# EAGLE board ECDL_CUR_CTRL (EAGLE 8.6.3)
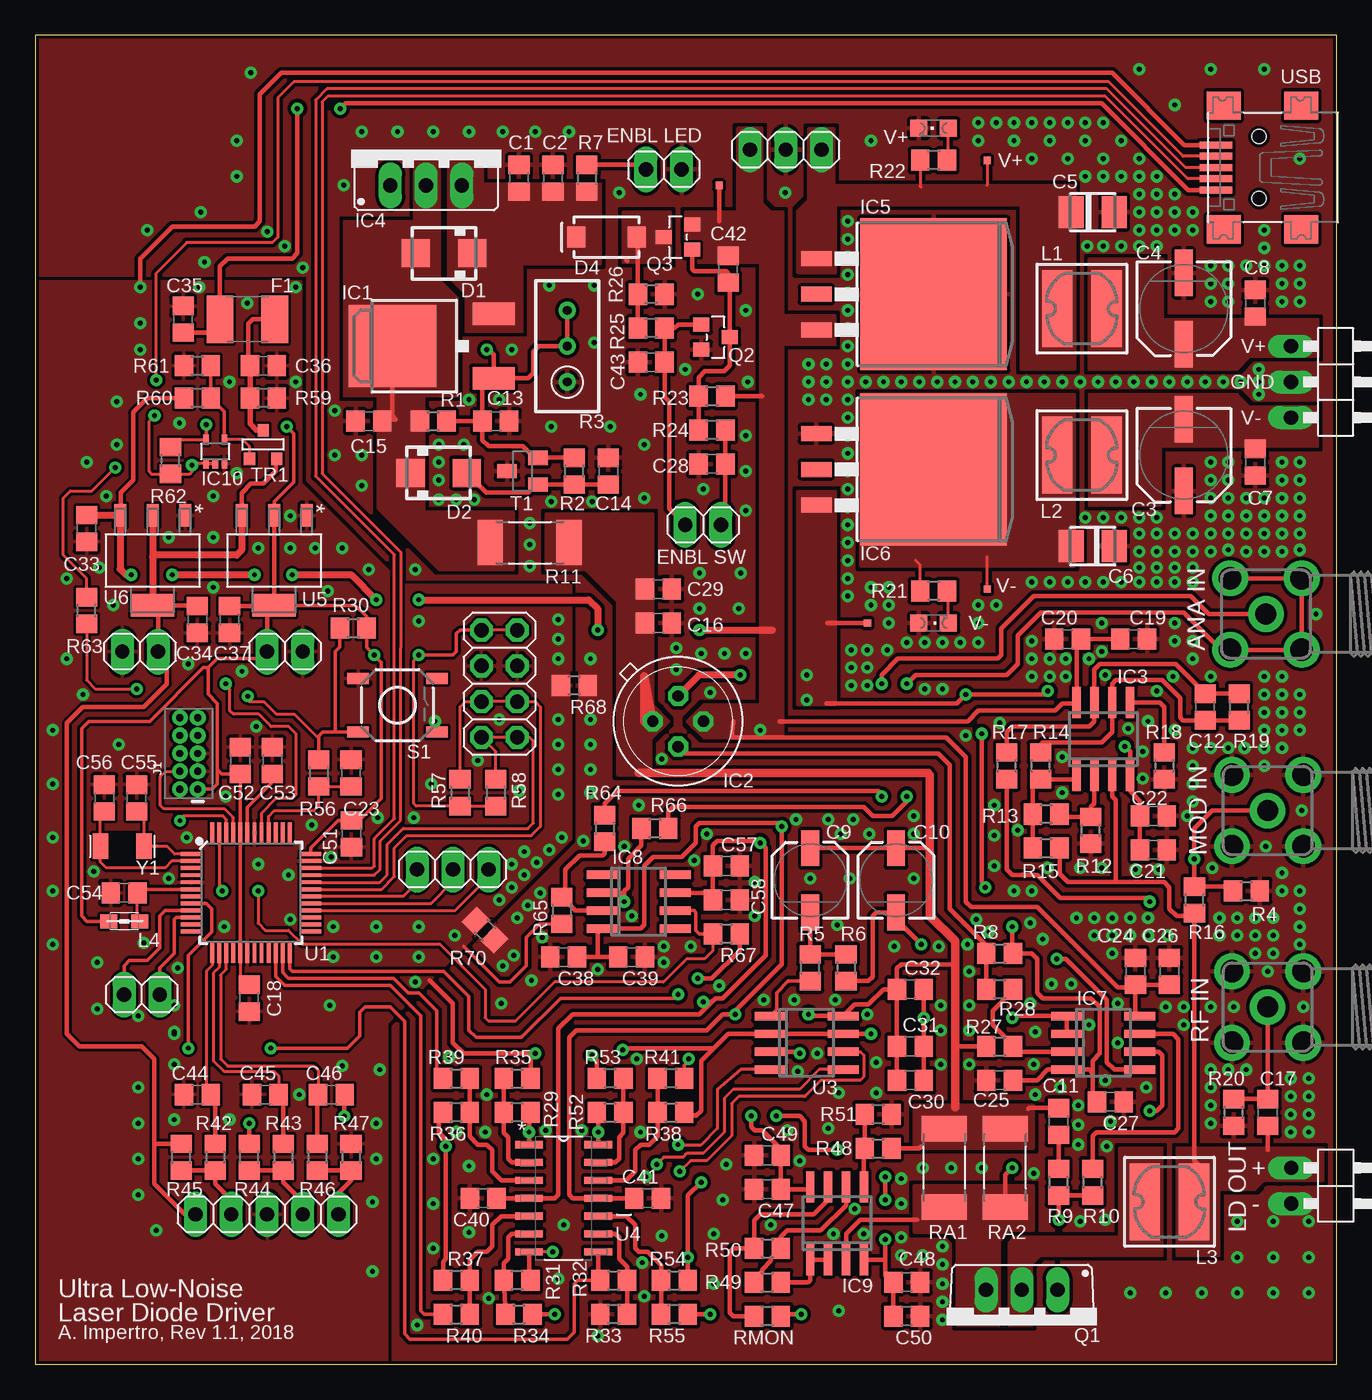
[diagram p2: board, top side]
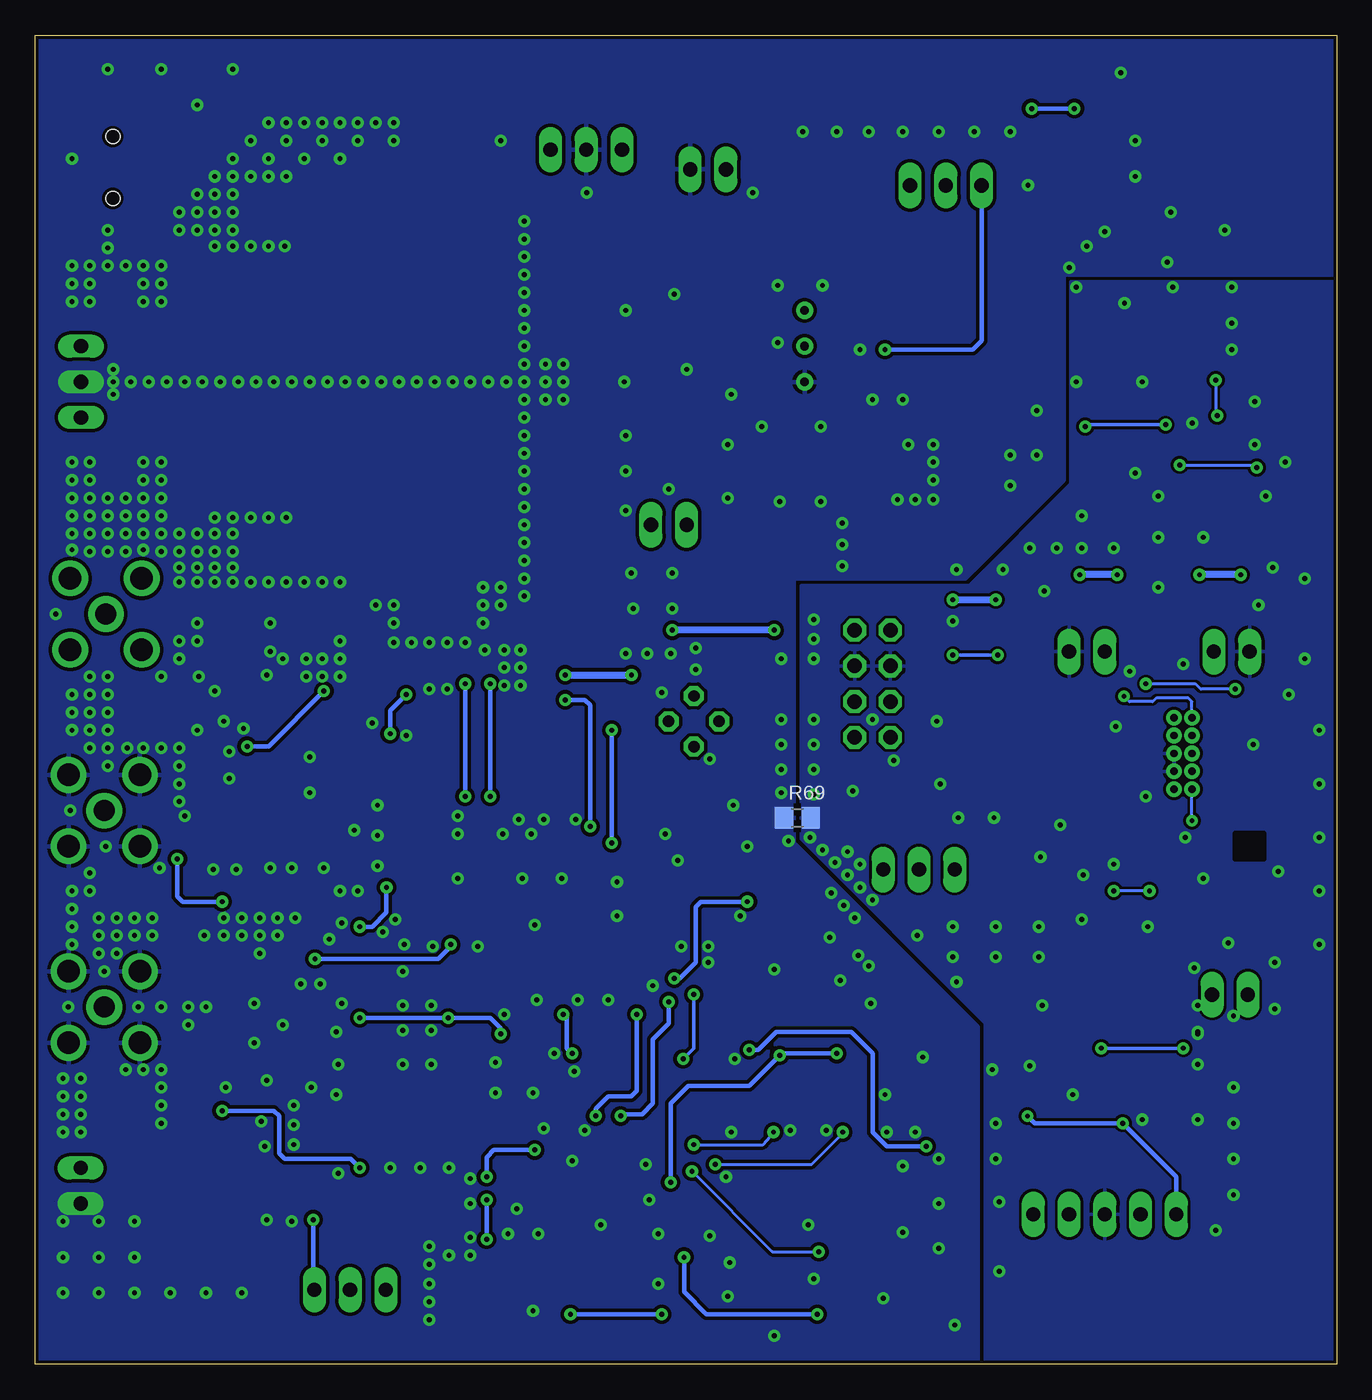
[diagram p3: board, bottom side, seen from below]

Size 92.5 x 94.5 mm. Coordinates in mm from the lower left corner, seen from the top.
Outline: 0,0 92.5,0 92.5,94.5 0,94.5 0,0
Copper layers (1*16): Top 0.035mm / dielectric 1.5mm / Bottom 0.035mm
Design rules "SparkFun": minimum track width 8mil, minimum drill 13mil, track to track 8mil, track to pad 8mil, pad to pad 8mil, via to via 8mil, smd to smd 8mil, copper to edge 10mil, drill to drill 8mil, minimum pad ring 12mil, minimum via ring 10mil, stop-mask expansion 4mil, vias tented up to drill 25mil, thermal gap 10mil

## Footprints (pad centres in the part's own frame; a part is rotated, then mirrored left to right if it is on the bottom)
C0805 = smd 1.3 x 1.5: 1 -0.95,0; 2 0.95,0
CSV-D = smd 3.302 x 1.27: + -2.54,0; - 2.54,0
C3528-21R/T = smd 1.778 x 2.286: + 1.525,0; - -1.525,0
CSV-C = smd 2.54 x 1.27: + -2.286,0; - 2.286,0
SMA = smd 2 x 2: A 2,0; C -2,0
SMA-DIODE = smd 1.27 x 1.47: A -2.15,0; C 2.15,0
PROTEZIONE_L1812 = smd 1.9 x 3.4: 1 -1.95,0; 2 1.95,0
DPACK = smd 1.6 x 3: 1 -2.28,-4.8; 3 2.28,-4.8 | smd 5.8 x 6.2: 4 0,2.38
TO39/4 = drill 0.813 octagon: 1 -1.27,-1.27; 2 1.27,-1.27; 3 1.27,1.27; 4 -1.27,1.27
SO08 = smd 0.6 x 2.2: 1 -1.905,-2.6; 2 -0.635,-2.6; 3 0.635,-2.6; 4 1.905,-2.6; 5 1.905,2.6; 6 0.635,2.6; 7 -0.635,2.6; 8 -1.905,2.6
317TS = drill 1.016 long: 1 -2.54,-2.54; 2 0,-2.54; 3 2.54,-2.54
TO263-3 = smd 1.067 x 2.159: 1 -2.54,-5.791; 2 0,-5.791; 3 2.54,-5.791 | smd 10.8 x 10.41: TAB 0,2.54
TO223-3 = smd 1.067 x 2.159: 1 -2.54,-7.061; 2 0,-7.061; 3 2.54,-7.061 | smd 10.8 x 10.41: TAB 0,1.27
SO8 = smd 0.6 x 2.2: 1 -1.905,-2.6; 2 -0.635,-2.6; 3 0.635,-2.6; 4 1.905,-2.6; 5 1.905,2.6; 6 0.635,2.6; 7 -0.635,2.6; 8 -1.905,2.6
INTEGRATEDCIRCUITS_SC70-5 = smd 0.4 x 0.7: 1 -0.65,-0.85; 2 0,-0.85; 3 0.65,-0.85; 4 0.65,0.85; 5 -0.65,0.85
2X5-PTH-1.27MM = drill 0.508 pad 1: 1 -2.54,-0.635; 2 -2.54,0.635; 3 -1.27,-0.635; 4 -1.27,0.635; 5 0,-0.635; 6 0,0.635; 7 1.27,-0.635; 8 1.27,0.635; 9 2.54,-0.635; 10 2.54,0.635
1X02 = drill 1.016 long: 1 -1.27,0; 2 1.27,0
1X03/90 = drill 1.016 long: 1 -2.54,-3.81; 2 0,-3.81; 3 2.54,-3.81
2X04 = drill 1.016 octagon: 1 -3.81,-1.27; 2 -3.81,1.27; 3 -1.27,-1.27; 4 -1.27,1.27; 5 1.27,-1.27; 6 1.27,1.27; 7 3.81,-1.27; 8 3.81,1.27
1X02/90 = drill 1.016 long: 1 -1.27,-3.81; 2 1.27,-3.81
1X05 = drill 1.016 long: 1 -5.08,0; 2 -2.54,0; 3 0,0; 4 2.54,0; 5 5.08,0
1X03 = drill 1.016 long: 1 -2.54,0; 2 0,0; 3 2.54,0
CD54 = smd 5.5 x 2.15: 1 0,1.75; 2 0,-1.75
PROTEZIONE_0805 = smd 1.2 x 1: 1 -1.1,0; 2 1.1,0
TO220BV = drill 1.016 long: D 0,-2.54; G -2.54,-2.54; S 2.54,-2.54
SOT-23 = smd 1.016 x 1.143: 1 -0.889,-1.016; 2 0.889,-1.016; 3 0,1.016
R0805 = smd 1.3 x 1.5: 1 -0.95,0; 2 0.95,0
RTRIM3296W = drill 0.61: 1 0,-2.54; 2 0,0; 3 0,2.54
R2512 = smd 1.8 x 3.2: 1 -2.8,0; 2 2.8,0
TACTILE_SWITCH_SMD_5.2MM = smd 1.524 x 0.762: 1 -2.794,1.905; 2 2.794,1.905; 3 -2.794,-1.905; 4 2.794,-1.905
SOT23-BEC = smd 1 x 1.4: B -0.95,-1.1; C 0,1.1; E 0.95,-1.1
PAD.02X.02 = smd 0.508 x 0.508: P$1 0,0
TRANSISTORS_SOT-23 = smd 0.787 x 0.889: 1 0.025,-1.016; 2 -0.94,1.016; 3 0.991,1.016
TQFP-48 = smd 1.5 x 0.28: 1 -4.25,2.75; 2 -4.25,2.25; 3 -4.25,1.75; 4 -4.25,1.25; 5 -4.25,0.75; 6 -4.25,0.25; 7 -4.25,-0.25; 8 -4.25,-0.75; 9 -4.25,-1.25; 10 -4.25,-1.75; 11 -4.25,-2.25; 12 -4.25,-2.75; 25 4.25,-2.75; 26 4.25,-2.25; 27 4.25,-1.75; 28 4.25,-1.25; 29 4.25,-0.75; 30 4.25,-0.25; 31 4.25,0.25; 32 4.25,0.75; 33 4.25,1.25; 34 4.25,1.75; 35 4.25,2.25; 36 4.25,2.75 | smd 0.28 x 1.5: 13 -2.75,-4.25; 14 -2.25,-4.25; 15 -1.75,-4.25; 16 -1.25,-4.25; 17 -0.75,-4.25; 18 -0.25,-4.25; 19 0.25,-4.25; 20 0.75,-4.25; 21 1.25,-4.25; 22 1.75,-4.25; 23 2.25,-4.25; 24 2.75,-4.25; 37 2.75,4.25; 38 2.25,4.25; 39 1.75,4.25; 40 1.25,4.25; 41 0.75,4.25; 42 0.25,4.25; 43 -0.25,4.25; 44 -0.75,4.25; 45 -1.25,4.25; 46 -1.75,4.25; 47 -2.25,4.25; 48 -2.75,4.25
SOIC-8 = smd 0.6 x 2.2: 1 -1.905,-2.6; 2 -0.635,-2.6; 3 0.635,-2.6; 4 1.905,-2.6; 5 1.905,2.6; 6 0.635,2.6; 7 -0.635,2.6; 8 -1.905,2.6
SOIC127P600X175-14N = smd 1.981 x 0.508: 1 -2.464,3.81; 2 -2.464,2.54; 3 -2.464,1.27; 4 -2.464,0; 5 -2.464,-1.27; 6 -2.464,-2.54; 7 -2.464,-3.81; 8 2.464,-3.81; 9 2.464,-2.54; 10 2.464,-1.27; 11 2.464,0; 12 2.464,1.27; 13 2.464,2.54; 14 2.464,3.81
SOT230P696X180-4N = smd 1.6 x 0.838: 1 -3.2,2.311; 2 -3.2,0; 3 -3.2,-2.311 | smd 1.6 x 3.099: 4 3.2,0
USB-MINIB = smd 0.5 x 2.308: D+ 0,4.064; D- -0.8,4.064; GND 1.6,4.064; ID 0.8,4.064; VBUS -1.6,4.064 | smd 2 x 2.4: GND1 -4.4,-2; GND2 -4.4,3.5; GND3 4.4,3.5; GND4 4.4,-2 | hole 1: -2.2,1; 2.2,1
CHIPLED_0805 = smd 1.2 x 1.2: A 0,-1.05; C 0,1.05
SMA90_DIP = drill 1.5 pad 2.54: ANTENNA 0,0 | drill 1.6 pad 2.54: GND1 -2.54,2.54; GND2 2.54,2.54; GND3 -2.54,-2.54; GND4 2.54,-2.54
CRISTALLI_RESONATOR_EPSON_FC_145 = smd 1.1 x 1.8: P$1 -1.55,0; P$2 1.55,0

## Placement (x,y rotation side)
C1  10nF  [C0805]  34.39,84.33 90 top
C2  10uF  [C0805]  36.8,84.33 90 top
C3  220uF  [CSV-D]  81.63,64.64 90 top
C4  220uF  [CSV-D]  81.63,75.06 90 top
C5  47uF  [C3528-21R/T]  75.15,81.92 180 top
C6  47uF  [C3528-21R/T]  75.15,58.17 0 top
C7  1uF  [C0805]  86.71,64.14 90 top
C8  1uF  [C0805]  86.71,75.44 90 top
C9  22uF  [CSV-C]  55.09,34.42 270 top
C10  22uF  [CSV-C]  61.18,34.42 270 top
C11  33nF  [C0805]  72.74,17.27 270 top
C12  1uF  [C0805]  83.15,46.74 90 top
C13  10uF  [C0805]  32.73,67.06 0 top
C14  1uF  [C0805]  40.74,63.5 90 top
C15  10uF  [C0805]  23.72,67.06 180 top
C16  22uF  [C0805]  44.29,52.7 0 top
C17  .01uF  [C0805]  87.6,17.91 90 top
C18  100nF  [C0805]  15.21,26.04 270 top
C19  100nF  [C0805]  78.07,51.56 0 top
C20  10uF  [C0805]  73.38,51.56 180 top
C21  10uF  [C0805]  79.47,36.58 0 top
C22  100nF  [C0805]  79.47,38.99 0 top
C23  10nF  [C0805]  22.45,42.04 90 top
C24  10uF  [C0805]  78.2,27.94 90 top
C25  10uF  [C0805]  68.55,20.19 0 top
C26  100nF  [C0805]  80.61,27.94 90 top
C27  100nF  [C0805]  76.42,18.67 180 top
C28  1uF  [C0805]  48.1,64.01 180 top
C29  100nF  [C0805]  44.29,55.12 0 top
C30  10uF  [C0805]  62.2,20.19 0 top
C31  100nF  [C0805]  62.2,22.61 0 top
C32  100nF  [C0805]  62.2,26.67 0 top
C33  10uF  [C0805]  3.65,59.44 270 top
C34  10uF  [C0805]  11.53,52.96 270 top
C35  10nF  [C0805]  10.51,74.3 90 top
C36  10uF  [C0805]  16.23,70.99 180 top
C37  10uF  [C0805]  13.81,52.96 270 top
C38  100nF  [C0805]  37.56,28.96 0 top
C39  10uF  [C0805]  42.39,28.96 180 top
C40  100nF  [C0805]  31.85,11.81 180 top
C41  100nF  [C0805]  43.53,11.81 0 top
C42  0.1uF  [C0805]  49.24,77.85 270 top
C43  0.1uF  [C0805]  43.78,71.25 180 top
C44  100nF  [C0805]  11.53,19.18 180 top
C45  100nF  [C0805]  16.35,19.18 180 top
C46  100nF  [C0805]  21.05,19.18 180 top
C47  10uF  [C0805]  52.04,12.45 180 top
C48  10uF  [C0805]  61.95,5.84 180 top
C49  100nF  [C0805]  52.04,14.86 180 top
C50  100nF  [C0805]  61.95,3.43 180 top
C51  100nF  [C0805]  22.48,37.72 270 top
C52  100nF  [C0805]  14.57,42.93 90 top
C53  1uF  [C0805]  16.86,42.93 90 top
C54  100nF  [C0805]  6.32,33.53 180 top
C55  22pF  [C0805]  7.21,40.26 270 top
C56  22pF  [C0805]  4.92,40.26 270 top
C57  10uF  [C0805]  49.12,35.43 0 top
C58  100nF  [C0805]  49.12,33.02 180 top
D1  1N4001  [SMA]  29.05,78.99 180 top
D2  1N4001  [SMA]  28.67,63.37 0 top
D4  3A/40V/500mV  [SMA-DIODE]  40.61,80.14 180 top
F1  MF-MSMF050-2 500mA  [PROTEZIONE_L1812]  15.08,74.3 0 top
IC1  LM317MDT  [DPACK]  27.78,72.39 90 top
IC2  LM399H  [TO39/4]  45.69,45.72 315 top
IC3  OPA2227D  [SO08]  75.92,44.45 0 top
IC4  [317TS]  27.78,86.36 0 top
IC5  LM340S-12  [TO263-3]  61.31,76.07 270 top
IC6  L7912  [TO223-3]  62.58,63.63 270 top
IC7  AD8676  [SO8]  75.92,22.86 270 top
IC8  TL071D  [SO08]  42.9,32.89 270 top
IC9  AD8676  [SO8]  56.99,10.03 0 top
IC10  74LVC1G125DCKR  [INTEGRATEDCIRCUITS_SC70-5]  12.8,64.9 0 top
J1  CORTEX_DEBUG_PTH  [2X5-PTH-1.27MM]  10.92,43.43 90 top
JP1  ENBL  [1X02]  47.47,59.69 0 top
JP2  [1X03/90]  93.06,69.85 270 top
JP3  [2X04]  32.99,48.39 270 top
JP4  [1X02/90]  93.08,12.7 270 top
JP5  EN_LED  [1X02]  44.67,84.96 0 top
JP7  [1X05]  16.48,10.67 0 top
JP8  [1X02]  7.59,26.29 180 top
JP9  [1X02]  7.46,50.67 180 top
JP10  [1X03]  29.69,35.18 180 top
JP11  [1X02]  17.75,50.67 0 top
JP12  [1X03]  53.34,86.36 180 top
L1  CD54  [CD54]  74.39,75.06 270 top
L2  CD54  [CD54]  74.39,64.64 90 top
L3  100uH  [CD54]  80.61,11.56 90 top
L4  MH2029-300Y  [PROTEZIONE_0805]  6.32,31.5 180 top
Q1  IRF9Z14  [TO220BV]  70.12,2.76 180 top
Q2  2N7002  [SOT-23]  48.36,73.03 270 top
Q3  SSM3J328R,LF  [SOT-23]  45.69,80.14 90 top
R1  240R  [R0805]  28.29,67.06 0 top
R2  50K  [R0805]  38.32,63.5 90 top
R3  5K  [RTRIM3296W]  37.81,72.39 0 top
R4  50R  [R0805]  86.08,33.66 0 top
R5  3K  [R0805]  55.09,28.19 90 top
R6  3K  [R0805]  57.63,28.19 270 top
R7  1K  [R0805]  39.21,84.33 270 top
R8  7.5K  [R0805]  68.55,29.21 0 top
R9  100R  [R0805]  72.74,12.95 90 top
R10  10K  [R0805]  75.15,12.95 90 top
R11  1.5R  [R2512]  35.15,58.42 0 top
R12  1K  [R0805]  75.03,37.97 90 top
R13  1K  [R0805]  71.85,39.12 180 top
R14  1K  [R0805]  71.47,42.55 90 top
R15  1K  [R0805]  71.85,36.7 0 top
R16  1K  [R0805]  82.39,33.02 90 top
R17  2K  [R0805]  69.06,42.55 90 top
R18  1K  [R0805]  80.23,42.55 270 top
R19  1K  [R0805]  85.57,46.74 90 top
R20  10K  [R0805]  85.19,17.91 90 top
R21  2K  [R0805]  63.85,54.99 180 top
R22  2K  [R0805]  63.85,85.6 180 top
R23  10K  [R0805]  48.1,68.83 0 top
R24  100K  [R0805]  48.1,66.42 180 top
R25  10K  [R0805]  43.78,73.66 180 top
R26  10K  [R0805]  43.78,76.07 180 top
R27  28.7K  [R0805]  68.55,22.61 0 top
R28  11K  [R0805]  68.55,26.67 180 top
R29  10K  [R0805]  34.26,17.91 180 top
R30  10K  [R0805]  22.61,52.35 0 top
R31  10K  [R0805]  34.26,5.97 180 top
R32  10K  [R0805]  41.12,5.97 0 top
R33  10K  [R0805]  41.12,3.56 180 top
R34  10K  [R0805]  34.39,3.56 0 top
R35  10K  [R0805]  34.26,20.32 0 top
R36  10K  [R0805]  29.94,17.91 180 top
R37  10K  [R0805]  29.94,5.97 180 top
R38  10K  [R0805]  45.18,17.91 0 top
R39  10K  [R0805]  29.94,20.32 0 top
R40  10K  [R0805]  29.94,3.56 0 top
R41  10K  [R0805]  45.18,20.32 180 top
R42  10K  [R0805]  12.8,14.73 270 top
R43  10K  [R0805]  17.62,14.73 270 top
R44  10K  [R0805]  15.21,14.73 90 top
R45  10K  [R0805]  10.38,14.73 90 top
R46  10K  [R0805]  20.04,14.73 270 top
R47  100K  [R0805]  22.45,14.73 270 top
R48  10K  [R0805]  59.91,15.37 0 top
R49  10K  [R0805]  52.04,5.84 0 top
R50  10K  [R0805]  52.04,8.26 0 top
R51  10K  [R0805]  59.91,17.78 180 top
R52  10K  [R0805]  40.86,17.91 0 top
R53  10K  [R0805]  40.86,20.32 180 top
R54  10K  [R0805]  45.44,5.97 0 top
R55  10K  [R0805]  45.44,3.56 180 top
R56  330R  [R0805]  20.16,42.04 270 top
R57  10K  [R0805]  30.2,40.64 270 top
R58  10K  [R0805]  32.73,40.64 270 top
R59  10K  [R0805]  16.23,68.71 180 top
R60  100K  [R0805]  11.53,68.71 180 top
R61  100K  [R0805]  11.53,70.99 0 top
R62  100K  [R0805]  9.62,64.26 90 top
R63  330R  [R0805]  3.65,53.59 90 top
R64  10K  [R0805]  40.48,38.1 270 top
R65  10K  [R0805]  37.43,32.26 270 top
R66  10K  [R0805]  44.04,38.1 180 top
R67  10K  [R0805]  49.12,30.61 180 top
R68  0R  [R0805]  38.32,48.26 180 top
R69  0R  [R0805]  38.32,38.86 0 bottom
R70  0R  [R0805]  31.97,30.86 135 top
RA1  100R  [R2512]  64.61,13.97 90 top
RA2  100R  [R2512]  68.93,13.97 90 top
RMON  50R or 0R  [R0805]  52.04,3.43 180 top
S1  MOM SWITCH  [TACTILE_SWITCH_SMD_5.2MM]  25.75,46.86 0 top
T1  MMBT2907  [SOT23-BEC]  34.64,63.5 90 top
TP1  [PAD.02X.02]  67.66,85.6 0 top
TP2  [PAD.02X.02]  67.66,55.12 0 top
TP3  [PAD.02X.02]  48.61,83.82 0 top
TP4  [PAD.02X.02]  59.15,52.7 0 top
TR1  PMV48XP  [TRANSISTORS_SOT-23]  16.23,65.41 180 top
U1  ATSAMD21G-A  [TQFP-48]  15.34,33.53 0 top
U3  AD5541  [SOIC-8]  54.83,22.86 270 top
U4  TS514AID  [SOIC127P600X175-14N]  37.56,11.81 0 top
U5  LM1117IMP-3.3  [SOT230P696X180-4N]  16.99,57.15 270 top
U6  LM1117IMP-5.0  [SOT230P696X180-4N]  8.35,57.15 270 top
USB  [USB-MINIB]  87.98,85.09 90 top
V+  [CHIPLED_0805]  63.85,87.88 90 top
V-  [CHIPLED_0805]  63.85,52.7 270 top
X1  [SMA90_DIP]  87.59,39.37 270 top
X2  [SMA90_DIP]  87.59,25.4 270 top
X3  [SMA90_DIP]  87.47,53.34 270 top
Y1  32,768Khz_SMD  [CRISTALLI_RESONATOR_EPSON_FC_145]  6.19,36.83 0 top

## Tracks (layer width: path | path; a pad name or v marks a point on that pad's centre or on a via)
+3V3  (via drill 0.35)
  Top 0.203: U1.17 14.59,26.72 C18.1 | JP3.2 JP3.1 | v27.27,50.42 26.89,50.04 26.89,39.88 27.08,39.69 R57.2 R58.2 | R62.2 9.97,65.75 IC10.5
  Top 0.254: v12.16,66.8 12.15,66.66 IC10.5 | U1.17 U1.44 14.59,41.96 C52.1 13.27,41.98 12.95,42.29 | 12.29,49.53 12.92,50.16 16.23,50.16 16.48,50.42 JP11.1 | v17.88,66.67 18.38,66.17 18.38,62.74 16.99,61.34 U5.2 | U5.4 22.76,53.95 23.56,53.15 R30.2 23.56,50.96 v24.1,50.42 24.61,49.91 24.61,40.23 23.05,38.67 C51.1 21.52,38.67 19.59,36.73 U1.36 | v27.27,50.42 29.69,50.42 29.94,50.67 29.94,51.94 30.2,52.2 JP3.1 | 12.29,49.53 12.29,47.66 12.95,46.99 12.95,42.29 | J1.1 12.57,40.89 12.95,41.27 12.95,42.29 | L4.2 3.68,31.5 3.3,31.88 3.3,45.21 3.81,45.72 8.13,45.72 11.94,49.53 12.29,49.53
  Top 0.305: C37.1 16.95,53.91 | 16.99,53.91 16.95,53.91 | U5.2 U5.4 | U5.4 16.95,53.91 | U5.4 16.48,53.44 JP11.1
  Bottom 0.254: v12.16,66.8 17.75,66.8 v17.88,66.67 | v27.27,50.42 v24.1,50.42
+5V  (via drill 0.33, 0.35)
  Top 0.305: 10.06,16.06 R45.2 8.54,15.68 8.48,15.75 | JP7.1 10.64,10.67 8.48,12.83 8.48,15.75 | R44.2 v15.21,17.14 | 9.24,53.95 U6.4 8.73,53.57 JP9.1 9.37,50.04 9.37,48.39 7.72,46.74 3.4,46.74 2.25,45.59 2.25,23.5 3.14,22.61 7.59,22.61 8.48,21.72 8.48,15.75 | 9.24,53.95 11.48,53.95 C34.1 | U5.3 14.68,61.95 15.34,62.61 16.23,62.61 17.11,63.5 17.11,64.34 TR1.2 | 9.37,53.82 9.24,53.95 | v21.97,17.65 21.97,19.15 C46.1
  Top 0.508: U6.2 8.35,57.4 | 8.35,57.4 U6.4 | U5.3 14.68,57.89 14.32,57.53 8.48,57.53 8.35,57.4
  Bottom 0.305: JP7.1 11.4,13.34 v15.21,17.14 21.46,17.14 v21.97,17.65
+12V  (via drill 0.35)
  Top 0.305: TP3.P$1 48.61,81.28 | R23.2 51.66,68.83 | 74.01,47.95 73.88,46.99 | 49.63,45.72 49.5,44.58 64.74,44.58 66.14,43.18 66.14,32.89 66.52,32.51 71.22,32.51 76.93,26.8 78.2,26.8 | 73.88,46.99 IC3.8 74.01,51.25 C20.1 C19.1 | C40.1 U4.4 36.93,11.81 37.18,12.06 37.18,23.88 38.2,24.89 47.21,24.89 48.1,25.78 | IC9.8 54.9,12.45 C47.1 C49.1 52.99,15.31 51.66,16.64 51.15,16.64 50.9,16.89 v50.9,17.65 | C26.1 C24.1 78.2,26.8 | 78.2,26.8 78.2,25.08 IC7.8 | 73.88,46.99 72.99,46.99 72.49,46.48 67.03,46.48 66.26,45.72 52.93,45.72 | 48.1,25.78 48.36,26.04 48.86,26.04 51.91,29.08 51.91,36.7 v51.53,37.08 51.4,37.21 48.48,37.21 48.17,36.9 C57.1 C58.2 | v47.47,25.78 48.1,25.78 | R60.2 7.97,68.71 6.95,67.69 6.95,62.87 6.07,61.98 6.07,60.38 U6.3 | 48.04,32.89 C58.2 | IC8.7 47.66,33.53 C58.2
  Top 0.508: C33.1 3.69,60.35 U6.3 6.04,56.54 6.45,56.13 v6.83,56.13 | v47.21,52.2 52.42,52.2 | v9.75,56.13 v15.59,56.13 | v18.26,56.13 22.45,56.13 v24.23,54.36 | v27.27,54.36 39.34,54.36 39.97,53.72 v39.97,52.2
  Bottom 0.305: v51.53,37.08 v51.53,45.09 | v50.9,17.65 50.77,17.78 49.37,17.78 48.61,18.54 48.61,23.11 47.47,24.26 v47.47,25.78
  Bottom 0.508: v39.97,52.2 v47.21,52.2 | v6.83,56.13 v9.75,56.13 | v15.59,56.13 v18.26,56.13 | v24.23,54.36 v27.27,54.36
  pour Top (no thermals): 53.18,81.92 52.32,81.92 51.69,82.55 51.69,87.88 49.91,87.88 49.91,81.92 46.2,81.92 46.2,78.36 51.53,78.36 51.53,46.86 53.18,46.86 53.18,72.52 56.87,72.52 56.87,74.55 53.18,74.55
  pour Top (no thermals): 53.18,46.86 47.47,46.86 46.32,45.72 47.47,44.58 53.18,44.58
+15V
  pour Top (no thermals): 91.16,71.63 86.33,71.63 85.44,70.74 74.9,70.74 74.9,78.61 80.11,78.61 80.11,74.3 91.16,74.3
-12V  (via drill 0.35)
  Top 0.305: TP4.P$1 56.31,52.7 | C41.1 U4.11 38.2,11.81 37.94,12.06 37.94,23.24 38.45,23.75 47.72,23.75 48.86,24.89 49.5,24.89 | C27.2 75.15,18.99 75.15,20.7 | 75.15,20.7 74.9,20.95 IC7.4 71.98,20.95 71.22,20.19 C25.2 | C21.1 C22.1 78.52,40.07 77.82,40.77 IC3.4 77.82,43.56 v77.44,43.94 | v71.98,47.88 71.98,47.75 71.85,47.62 v66.14,47.62 65.5,46.99 56.23,46.99 | v67.53,33.91 67.28,34.29 v67.28,44.83 | 75.15,20.7 75.15,21.59 75.66,22.1 75.66,25.4 75.03,26.04 71.6,26.04 71.22,26.42 71.22,28.83 70.83,29.21 R8.2 69.44,29.21 v69.44,31.11 | 60.42,7.49 v60.42,8.89 | C48.2 60.99,5.71 | 60.99,5.71 C50.2 | 60.42,7.49 60.42,6.29 60.99,5.71 | 60.42,7.49 60.36,7.43 IC9.4 | v60.42,11.68 v60.42,13.34 | v56.99,15.24 54.96,15.24 54.71,15.49 54.71,17.27 54.33,17.65 v52.67,17.65 | v49.75,24.89 49.5,24.89 | 49.5,24.89 53.05,28.45 v53.05,38.23 52.8,38.48 47.21,38.48 46.96,38.23 46.96,37.08 45.94,36.07 43.91,36.07 43.28,35.43 43.28,31.24 43.02,30.99 IC8.4 39.97,30.67 39.97,28.96 | C39.2 39.97,28.96 | 39.97,28.96 C38.2
  Top 0.508: v50.12,49.02 47.2,49.02 IC2.4
  Bottom 0.305: v71.98,47.88 75.92,43.94 v77.44,43.94 | v67.53,33.91 67.53,32.13 68.55,31.11 v69.44,31.11 | v60.42,8.89 v60.42,11.68 | v60.42,13.34 60.42,14.73 59.91,15.24 v56.99,15.24 | v52.67,17.65 52.67,18.16 51.78,19.05 50.13,19.05 49.75,19.43 v49.75,24.89 | v67.28,44.83 67.28,46.48 v66.14,47.62 | v53.05,38.23 53.05,46.86 53.44,47.24 v54.83,47.24
  Bottom 0.508: v54.83,49.02 v50.12,49.02
  pour Top (no thermals): 54.2,46.86 54.2,62.1 56.87,62.1 56.87,46.86
-15V
  pour Top (no thermals): 91.16,68.07 86.33,68.07 85.44,68.96 74.9,68.96 74.9,61.09 79.98,61.09 79.98,65.28 91.16,65.28
CS_DAC  (via drill 0.35)
  Top 0.254: R41.1 46.13,21.27 46.58,21.72 v46.45,21.72 | v45.69,26.29 45.44,26.04 37.34,26.04 34.54,23.24 31.34,23.24 30.83,23.75 30.83,26.16 29.05,27.94 18.26,27.94 18.09,28.11 U1.24
  Bottom 0.254: v46.45,21.72 45.69,22.48 v45.69,26.29
DACGND  (via drill 0.35)
  Top 0.305: IC7.2 IC7.1 69.56,24.77 v69.44,24.64 | 28.61,6.1 R37.2 28.99,7.3 29.18,7.49 v29.18,15.49 29.18,16 28.67,16.51 28.67,17.46 R36.2 | C30.2 C31.2 v63.15,24.64 C32.2 | v59.41,23.5 U3.7 U3.2 49.24,23.5 48.23,22.48 | R38.2 46.96,17.65 47.34,18.03 47.34,21.59 48.23,22.48 | 48.23,22.48 41.88,22.48 v41.75,22.35
  Bottom 0.305: v59.41,23.5 59.41,23.88 60.17,24.64 v63.15,24.64 v69.44,24.64 | v41.75,22.35 41.12,22.35 39.85,23.62 34.51,23.62 32.99,22.1 32.99,16.51 31.97,15.49 v29.18,15.49
DCLK  (via drill 0.35)
  Top 0.203: U3.5 55.72,20.95 54.33,19.56 49.63,19.56 48.99,18.92 48.99,16.51 47.47,14.99 46.32,14.99 46.07,14.73 44.67,14.73 v44.16,14.22
  Top 0.305: 34.95,15.76 U4.1 v35.1,16.51 35.1,17.54 R29.1
  Bottom 0.203: v44.16,14.22 37.31,14.22 35.15,16.38 v35.1,16.51
DCS  (via drill 0.35)
  Top 0.203: U3.4 50.13,20.95 48.48,19.56 48.48,16.76 47.34,15.62 v45.69,15.62
  Top 0.305: R52.1 40.02,17.51 v40.02,16.51 U4.14
  Bottom 0.203: v45.69,15.62 40.79,15.62 v40.02,16.51
  Bottom 0.305: 39.97,16.38 v40.02,16.51
DCURMON  (via drill 0.35)
  Top 0.254: R32.1 38.58,5.97 38.32,5.71 38.32,2.29 37.81,1.78 26.64,1.78 26.26,2.16 26.26,24.38 25.24,25.4 23.46,25.4 23.08,25.02 23.08,23.37 22.19,22.48 v16.73,22.48 | v10.89,22.48 10.89,29.08 12.54,30.73 12.54,32.38 12.15,32.78 U1.8
  Top 0.305: R32.1 40.02,6.11 U4.8
  Bottom 0.254: v16.73,22.48 v10.89,22.48
DDATA  (via drill 0.35)
  Top 0.203: U3.6 58.64,22.23 58.9,21.97 58.9,20.45 58.64,20.19 55.85,20.19 54.71,19.05 50.01,19.05 49.5,18.54 49.5,16.26 47.72,14.48 46.58,14.48 v45.82,13.72 | v36.8,8 U4.7
  Top 0.305: U4.7 35.1,6.08 R31.1
  Bottom 0.203: v45.82,13.72 40.1,8 v36.8,8
DGND  (via drill 0.35)
  Top 0.203: U1.5 10.52,34.28 10.51,34.29
  Top 0.254: R65.2 35.85,31.31 34.89,30.35 34.89,28.32 33.75,27.18 32.99,27.18 30.45,29.72
  Top 0.305: v39.59,21.97 39.91,21.65 R53.2 | R35.2 35.21,21.78 v35.53,22.1 30.45,22.1 29.69,22.86 29.69,25.65 28.04,27.3 | R54.2 v46.38,7.62 46.38,12 v47.34,12.95 | v36.93,3.56 R34.2 | USB.GND 81.68,86.69 76.55,91.82 17.5,91.82 15.97,90.3 15.97,81.28 15.59,80.9 9.75,80.9 7.46,78.61 v7.46,76.58
  Bottom 0.254: 39.47,22.1 v39.59,21.97
  Bottom 0.305: v47.34,12.95 47.34,18.54 46.07,19.81 41.75,19.81 v39.59,21.97 | v46.38,7.62 46.38,5.14 44.8,3.56 v36.93,3.56 | v35.53,22.1 39.47,22.1
  other vias: 19.65,38.35 31.46,42.93 32.99,45.85 34.39,40.77 28.16,41.27 26.89,38.86 27.02,27.18 21.18,31.11 20.92,25.53 15.84,35.56 18,34.8 18.13,31.62 13.43,31.11 9.49,34.54 7.72,29.97 10.13,28.19 9.88,23.5 9.88,25.53 9.88,23.62 9.88,21.34 9.88,17.4 13.81,17.4 18.77,19.18 21.81,21.21 24.48,20.95 24.23,17.14 4.41,25.27 4.41,28.57 4.16,35.05 10.76,37.47 21.05,36.07 28.42,45.72 32.99,33.02 33.88,33.91 33.88,35.56 34.77,34.8 35.66,35.69 36.55,36.58 37.43,37.47 37.18,40.51 37.18,42.29 37.18,44.07 37.18,45.85 37.18,51.56 37.18,52.96 37.18,50.16 27.27,52.83 5.94,44.07 14.7,49.28 24.35,38.86 20.8,54.99 10.89,49.78 5.56,53.98 4.54,56.64 9.49,58.8 12.67,58.8 12.67,61.72 15.84,58.04 18.13,60.33 18.13,58.04 19.91,58.04 21.81,58.04 23.72,56.52 14.32,63.37 5.05,61.72 10.26,66.93 13.81,69.85 18.51,69.85 18.51,76.58 15.08,75.44 11.65,76.58 7.46,74.04 7.46,72.14 5.81,65.41 5.81,68.45 3.4,47.62 23.97,11.56 24.23,14.61 23.97,6.6 8.61,9.53 7.33,12.06 7.33,14.61 7.33,17.14 7.33,19.68 7.33,24.77 1.24,29.84 1.24,33.66 1.24,37.47 1.24,41.27 1.24,45.09 2.25,50.16 2.25,55.88 3.65,64.14 34.77,36.45 21.18,28.96 24.23,28.96 27.27,28.96 24.23,31.11 27.27,31.11 29.81,30.48 12.67,55.24 15.72,45.34 13.56,40.39
  pour Top (isolate 0.203, rank 6): -12.22,55.24 -12.1,76.96 18.89,76.96 18.89,62.61 26.13,55.37 38.07,55.37 38.07,37.34 24.99,24.26 24.99,-6.22 -12.22,-6.22
  pour Bottom (isolate 0.203, rank 6): -12.22,-6.22 -12.22,76.96 18.89,76.96 18.89,62.61 26.13,55.37 38.07,55.37 38.07,37.34 24.99,24.26 24.99,-6.22
  pour Top (no thermals): 29.94,31.5 31.97,33.53 32.99,32.51 30.96,30.48
  pour Top (no thermals): 37.94,49.4 36.16,49.4 36.16,47.12 37.94,47.12
  pour Bottom (no thermals): 37.94,40.01 36.29,40.01 36.29,37.72 37.94,37.72
ENCA
  Top 0.203: U1.14 13.09,28.23 12.67,27.81 12.67,21.59 13.43,20.83 16.99,20.83 17.3,20.51 C45.1
  Top 0.305: R43.1 17.62,19.24 C45.1
ENCB
  Top 0.203: U1.13 12.59,28.36 12.16,27.94 12.16,19.56 12.48,19.24 C44.1
  Top 0.305: R42.1 12.8,18.86 C44.1
ENCBTN
  Top 0.203: U1.15 13.59,28.09 13.18,27.69 13.18,21.72 13.69,21.21 19.78,21.21 20.1,20.89 C46.2
  Top 0.305: R46.1 20.04,18.98 C46.2
GND  (via drill 0.35)
  other vias: 90.52,20.32 61.56,7.75 62.83,69.85 81.88,69.85 43.28,65.41 31.21,61.47 77.69,45.21 50.52,74.93 39.72,76.71 50.52,60.71 30.83,68.58 72.99,40.64 74.26,35.31 52.29,9.91 56.74,9.27 58.26,11.05 61.56,13.21 43.28,61.59 36.67,61.34 35.15,56.77 28.67,61.47 28.67,64.14 30.45,65.41 35.15,59.82 33.88,72.14 36.55,76.71 36.67,66.67 63.09,13.97 65.12,13.97 67.28,13.97 74.26,10.16 76.04,10.29 58.9,9.27 61.56,11.43 61.56,9.02 71.09,23.62 70.96,21.34 66.39,23.75 66.39,25.53 66.39,21.34 66.39,27.94 71.09,19.18 72.87,19.68 74.14,18.41 76.04,20.19 76.93,22.86 74.9,24.13 76.93,25.65 73.63,27.05 72.23,27.05 70.71,25.65 70.71,31.37 71.6,30.23 64.23,29.72 57.88,34.54 62.45,34.54 66.9,31.62 67.79,30.73 74.14,17.02 74.14,15.62 76.42,17.27 78.96,19.68 70.96,13.59 76.17,15.49 81.63,25.4 80.36,25.4 66.26,29.84 83.53,20.95 83.53,19.68 83.53,18.41 83.53,25.4 85.19,25.4 89.25,20.32 89.25,19.05 90.52,19.05 90.14,25.4 87.6,27.94 76.55,29.21 59.79,19.3 59.15,24.89 64.36,21.34 64.36,23.75 64.36,25.53 56.87,25.91 53.94,25.91 30.83,9.4 55.59,22.1 54.2,20.83 56.99,31.24 59.79,21.46 56.36,16.76 53.44,16.64 42.77,21.72 63.09,7.75 43.4,13.34 36.29,16.64 72.99,43.18 70.83,48.9 68.55,45.59 68.17,39.75 68.17,37.59 68.17,35.43 69.82,37.97 78.2,35.18 79.85,35.18 81.88,38.99 71.98,35.31 75.79,35.31 61.06,29.72 55.09,34.54 16.48,80.52 86.96,69.85 80.61,69.85 79.34,69.85 74.26,69.85 72.99,69.85 71.72,69.85 69.18,69.85 64.1,69.85 61.56,69.85 59.02,69.85 54.96,71.12 54.96,68.58 56.23,71.12 56.23,68.58 57.75,71.12 57.75,66.04 57.75,64.77 57.75,63.5 57.75,60.96 57.75,57.15 57.75,55.88 59.41,53.98 57.75,73.66 57.75,76.2 57.75,78.74 57.75,80.01 78.45,79.5 79.72,79.5 81,80.64 19.02,77.98 17.75,79.5 12.03,78.36 66.14,44.7 91.03,53.34 80.87,48.9 76.04,49.02 27.15,2.79 28.29,11.43 32.1,19.18 51.78,25.91 44.67,28.57 39.97,28.07 46.58,29.72 44.67,29.72 42.39,31.88 51.15,34.29 51.15,31.88 46.83,35.81 47.72,37.72 42.9,39.75 41.88,36.83 54.07,38.73 56.36,38.73 58.13,38.73 57.25,37.72 59.28,37.72 62.45,38.99 62.45,37.72 43.02,16.51 57.12,19.3 54.33,14.48 64.48,7.11 64.48,5.71 64.48,4.45 64.48,3.17 64.48,8.38 57.12,3.81 48.23,5.71 48.23,9.27 44.55,9.14 48.86,11.68 49.12,14.22 43.15,7.24 43.28,4.83 37.56,9.91 37.18,6.1 32.23,4.7 28.29,8.26 28.29,14.61 30.83,14.1 29.94,16.51 31.97,16.51 29.43,21.84 38.83,16.64 48.61,26.92 74.01,31.75 75.28,31.75 76.55,31.75 77.82,31.75 79.09,31.75 75.28,30.48 76.55,30.48 77.82,30.48 79.09,30.48 80.49,30.48 70.83,33.66 69.56,33.66 81.63,24.13 84.81,20.95 86.08,20.95 83.53,17.14 89.25,17.78 90.52,17.78 90.52,16.51 89.25,16.51 84.17,31.75 84.17,30.48 85.44,31.75 85.44,30.48 86.71,31.75 86.71,30.48 86.71,29.21 87.98,29.21 87.98,30.48 87.98,31.75 83.66,35.31 78.71,41.66 78.71,43.56 79.09,45.72 82.27,43.81 82.27,42.55 82.27,41.27 82.27,40.01 83.53,43.81 84.81,43.81 85.95,43.81 81,45.09 79.72,47.88 75.79,50.67 74.9,50.16 72.11,48.9 72.11,50.16 70.83,51.44 70.83,50.16 73.25,48.9 73.25,50.16 75.79,52.7 81,52.7 81,51.44 82.27,51.44 82.27,50.16 83.53,48.9 64.48,48.01 63.22,48.01 58.01,48.26 59.15,48.26 58.01,49.53 59.15,49.53 59.15,50.8 58.01,50.8 60.55,50.8 47.98,47.75 44.55,43.05 33.12,25.65 35.27,27.3 33.24,28.32 34.01,29.08 34.26,31.75 35.02,32.64 35.91,33.53 36.04,30.35 39.47,45.85 39.47,44.07 39.47,42.29 39.47,50.16 45.56,49.4 47.34,50.55 48.99,50.55 50.52,50.55 45.56,50.93 47.21,53.72 50.01,53.72 38.96,37.21 39.47,40.64 39.97,2.03 77.82,5.08 80.36,5.08 82.9,5.08 85.44,5.08 85.44,7.62 85.44,10.16 47.47,62.23 50.52,63.5 50.52,66.04 50.64,69.85 46.2,70.74 39.72,72.64 47.09,76.07 39.59,61.34 28.67,65.41 28.67,62.87 29.94,61.47 40.86,66.67 32.99,68.58 43.02,68.96 23.21,64.64 23.21,62.48 27.02,56.52 35.15,58.29 21.3,64.64 21.3,67.82 21.94,83.82 23.21,87.63 25.75,87.63 28.29,87.63 30.83,87.63 33.24,87.63 35.53,87.63 37.94,87.63 53.31,83.31 41.5,83.31 50.13,56.26 47.21,56.26 57.75,58.42 57.75,59.69 57.75,62.23 57.75,67.31 57.75,68.58 57.75,69.85 57.75,72.39 57.75,74.93 57.75,77.47 57.75,81.28 60.29,69.85 65.37,69.85 66.64,69.85 67.91,69.85 70.45,69.85 75.53,69.85 76.8,69.85 78.07,69.85 83.15,69.85 84.42,69.85 85.69,69.85 86.96,70.74 86.96,68.96 88.61,75.56 89.89,75.56 89.89,76.83 88.61,76.83 88.61,78.11 89.89,78.11 87.34,78.11 86.08,78.11 84.81,78.11 83.53,78.11 83.53,76.83 84.81,76.83 84.81,75.56 83.53,75.56 87.34,79.38 87.34,80.64 82.27,80.64 82.27,81.92 81,81.92 81,83.19 79.72,83.19 79.72,81.92 79.72,80.64 78.45,80.64 78.45,81.92 78.45,83.19 79.72,84.45 78.45,85.72 77.19,87 75.92,88.27 74.64,88.27 73.38,88.27 72.11,88.27 70.83,88.27 69.56,88.27 68.3,88.27 67.03,88.27 77.19,79.5 75.92,79.5 74.77,79.5 77.19,84.45 75.92,84.45 74.64,84.45 78.45,84.45 67.03,87 69.56,87 72.11,87 74.64,87 70.83,85.72 73.38,85.72 75.92,85.72 59.41,87 56.23,69.85 54.96,69.85 67.03,51.31 67.03,52.7 67.03,53.98 68.3,53.98 65.75,51.31 64.48,51.31 63.22,51.31 61.95,51.31 60.67,52.7 60.67,53.98 57.75,54.61 59.41,55.24 60.67,55.24 70.83,55.63 72.11,55.63 73.38,55.63 74.64,55.63 75.92,55.63 77.19,55.63 78.45,55.63 79.72,55.63 81,55.63 82.27,55.63 75.92,60.2 77.19,60.2 78.45,60.2 78.45,59.05 78.45,57.78 78.45,56.64 79.72,57.78 79.72,59.05 79.72,60.2 81,59.05 82.27,59.05 82.27,57.78 81,57.78 79.72,56.64 81,56.64 82.27,56.64 83.53,59.05 84.81,59.05 86.08,59.05 87.34,59.05 88.61,59.05 89.89,59.05 89.89,57.91 88.61,57.78 87.34,57.78 86.08,57.78 84.81,57.91 83.53,57.78 83.53,60.33 84.81,60.33 86.08,60.33 87.34,60.33 88.61,60.33 89.89,60.33 89.89,61.59 89.89,62.87 89.89,64.14 88.61,64.14 88.61,62.87 88.61,61.59 87.34,61.59 86.08,61.59 84.81,61.59 83.53,61.59 83.53,62.87 83.53,64.14 84.81,64.14 84.81,62.87 74.64,60.2 89.89,33.66 88.61,34.92 89.89,31.11 89.89,45.09 89.89,46.35 89.89,47.62 88.61,48.9 87.34,48.9 87.34,47.62 88.61,47.62 88.61,46.35 87.34,46.35 87.34,45.09 88.61,45.09 88.61,43.81 87.34,43.81 87.34,42.55 90.01,39.37 87.47,36.83 88.61,33.66 89.89,32.38 89.89,29.84 87.98,10.16 87.98,7.62 87.98,5.08 90.52,5.08 90.52,7.62 90.52,10.16 15.34,91.82 14.32,87 14.32,84.45 11.78,81.92 7.97,80.64 81,89.53 78.45,92.08 83.53,92.08 87.34,92.08 89.89,85.72
  pour Top (isolate 0.254, rank 6): -18,105 99,105 99,-11.94 46.13,-11.94 25.5,-12.06 25.5,24 38.58,37.08 38.58,55.88 26.39,55.88 19.4,62.87 19.4,77.47 -17.94,77.47 -18,77.53
  pour Bottom (isolate 0.254, rank 6): -8.49,108.1 93.71,108.23 93.71,-2.32 46.5,-2.32 25.5,-2.41 25.5,24 38.58,37.08 38.58,55.88 26.4,55.88 19.4,62.88 19.4,77.47 -9.05,77.47 -9.13,77.56
  pour Top (no thermals): 87.34,70.99 91.16,70.99 91.16,68.83 87.34,68.83
  pour Bottom (no thermals): 87.34,70.87 91.03,70.87 91.03,68.83 87.34,68.83
  pour Top (no thermals): 87.47,12.57 91.03,12.57 91.03,10.41 87.47,10.41
  pour Bottom (no thermals): 87.47,12.45 91.03,12.45 91.03,10.41 87.47,10.41
  pour Top (no thermals): 32.35,28.7 34.13,30.48 33.12,31.5 31.34,29.72
  pour Top (no thermals): 38.7,49.4 40.35,49.4 40.35,47.12 38.7,47.12
  pour Bottom (no thermals): 38.7,40.01 40.23,40.01 40.23,37.72 38.7,37.72
MOSI_DAC
  Top 0.254: R40.1 27.66,3.56 27.4,3.81 27.4,24.77 25.24,26.92 17.75,26.92 17.09,27.59 U1.22
N$1  (via drill 0.35)
  Top 0.305: 31.97,69.85 31.59,69.85 | 31.97,69.85 32.32,69.85 32.53,70.06 IC1.1 | IC1.1 33.73,70.11 33.71,70.13 | IC1.1 32.58,71.78 32.23,72.14 v32.1,72.14 | R3.3 R3.2 35.78,72.39 35.4,72.01 35.4,70.48 35.03,70.11 IC1.1 | C13.1 31.79,69.53 31.97,69.85 | C13.1 R1.2 | R2.2 T1.E 35.47,64.45 34.64,65.28 32.23,65.28 31.79,65.72 C13.1
  Top 0.508: 32.49,70.1 32.53,70.06
  Bottom 0.305: v32.1,72.14 25.88,72.14 25.24,72.77 IC4.1
N$2
  pour Top (no thermals): 70.83,2.79 70.83,7.11 71.47,7.75 80.11,7.75 80.11,15.37 77.06,15.37 77.06,9.02 69.56,9.02 69.18,8.64 69.18,2.79
N$3
  Top 0.305: C14.1 R2.1 T1.B 35.68,62.49 | 35.67,62.48 35.68,62.49 | 35.68,62.49 35.68,62.61 35.04,61.98 32.07,61.98 D2.A
N$4
  Top 0.305: R9.2 C11.2
N$5
  Top 0.254: U3.1 52.7,25.24 52.7,26.42 53.53,27.24 R5.1
N$6
  Top 0.305: C9.- R5.2 R6.1
N$7  (via drill 0.35)
  Top 0.305: C10.- 61.44,31.37 | IC7.5 76.68,20.95 76.17,21.46 76.17,25.91 73.25,28.83 v72.61,28.83 | C10.- 61.18,31.62 v62.96,29.84 | R6.2 59.22,27.24 59.53,27.56 59.53,31.88 59.79,32.13 C10.-
  Bottom 0.305: v72.61,28.83 63.85,28.83 62.96,29.72 v62.96,29.84
N$8
  Top 0.305: R28.2 R8.1 67.6,29.78 64.99,32.38 64.99,42.61 64.17,43.43 46.18,43.43 IC2.2
N$9
  Top 0.305: 74.9,13.9 R10.2 75.15,16.26 75.41,16.51 81,16.51 81.25,16.76 81.25,23.11 80.87,23.5 IC7.7
N$10
  Top 0.305: R35.1 R29.2 33.31,16.44 33.62,16.13 33.62,14.61 33.88,14.35 U4.2
N$11  (via drill 0.35)
  Top 0.305: R10.1 R9.1 v72.74,10.29
  Bottom 0.305: v72.74,10.29 72.74,5.38 Q1.G
N$12
  Top 0.305: JP1.1 45.05,60.83 45.05,68.45 44.73,68.77 C43.1 R25.1 45.44,73.66 45.69,73.91 Q2.1
N$13  (via drill 0.35)
  Top 0.305: RA2.1 68.93,13.46 v69.44,13.97 | IC9.3 57.63,9.27 58.64,10.28 62.7,10.28 62.71,10.29 | IC7.6 79.85,22.23 80.11,21.97 80.11,18.41 79.72,18.03 v79.22,18.03
  Bottom 0.305: v79.22,18.03 75.53,18.03 75.15,17.65 75.15,14.99 74.77,14.61 70.07,14.61 v69.44,13.97
  pour Top (no thermals): 68.55,2.79 68.55,8.76 69.31,9.53 70.96,9.53 70.96,12.7 62.45,12.7 62.45,9.4 64.99,9.4 65.5,8.89 65.5,2.79
N$14
  Top 0.305: R14.2 71.34,43.94 71.6,44.2 75.79,44.2 76.55,44.96 IC3.6 76.55,48.39 76.8,48.64 80.11,48.64 81.38,47.37 81.38,45.97 81.56,45.79 C12.1 R19.1
N$15
  Top 0.305: R13.1 73.38,38.92 R12.2 75.03,39.62 75.28,39.88 IC3.2
N$16
  Top 0.305: 73.98,41.88 73.95,41.91 | 73.98,41.88 IC3.1 74.01,42.55 | R15.1 R13.2 | R13.2 71.22,39.18 | 73.98,41.88 73.69,41.59 R14.1 70.9,41.53 R13.2
N$17
  Top 0.305: R17.2 69.06,44.96 69.44,45.34 74.9,45.34 75.28,45.72 IC3.7 75.28,49.4 75.66,49.78 81.06,49.78 C12.2 R19.2
N$18  (via drill 0.35)
  Top 0.305: X1.ANTENNA 83.66,39.37 82.39,38.1 v82.39,35.94 R16.2 84.55,33.97 R4.1 | R17.1 69.06,35.18 69.44,34.8 71.22,34.8 72.87,33.15 78.96,33.15 v79.22,32.89
  Bottom 0.305: v79.22,32.89 82.01,32.89 82.39,33.27 v82.39,35.94
N$19
  Top 0.305: R18.1 80.23,46.74 79.92,47.05 IC3.5
N$20
  Top 0.305: C17.2 X2.ANTENNA | C17.2 | R20.2 85.45,18.86 C17.2
N$21
  Top 0.203: R22.1 64.9,85.7 V+.A
N$22
  Top 0.203: V-.C 64.9,54.89 R21.1
N$23
  Top 0.305: R39.2 R36.1 30.89,16.2 31.46,15.62 32.1,15.62 32.48,15.24 32.48,13.72 33.12,13.08 U4.3
N$24
  pour Top (no thermals): 40.23,78.23 40.23,83.95 31.85,83.95 31.85,85.72 29.31,85.72 29.31,77.34 30.58,76.07 30.58,73.41 34.64,73.41 34.64,78.23
N$25
  Top 0.203: L4.1 7.27,31.52 C54.1
  Top 0.254: C54.1 7.52,33.78 U1.6
N$26
  Top 0.305: 48.59,66.62 R24.1 C28.1 49.05,60.01 JP1.2 48.8,59.75
N$27
  Top 0.305: C15.1 25.62,67.18 25.37,67.44 25.37,72.36 IC1.4
  Top 1.016: IC1.4 25.91,72.9
  pour Top (no thermals): 26.89,85.72 26.89,81.28 21.94,81.28 21.94,68.83 30.07,68.83 30.07,75.82 28.8,77.09 28.8,85.72
  pour Top (no thermals): 24.35,68.96 24.35,60.83 28.67,56.52 34.01,56.52 34.01,60.58 27.66,60.58 27.66,68.96
N$28
  Top 0.305: R24.2 R23.1 47.15,70.17 47.59,70.61 48.99,70.61 49.37,70.99 Q2.3 49.37,76.71 49.24,76.83 C42.2 49.24,77.6 49.12,77.72 46.83,77.72 46.7,77.85 Q3.1
N$29
  Top 0.305: IC7.3 70.13,22.23 R27.2 69.5,22.67 68.04,24.13 68.04,25.15 69.5,26.6 R28.1
N$30
  Top 0.305: R25.2 R26.2 42.83,80.06 D4.A | 42.07,78.42 42.01,78.49
  pour Top (no thermals): 45.18,81.92 41.75,81.92 41.75,78.36 45.18,78.36
N$32
  Top 0.305: U4.6 33.88,9.27 33.62,9.02 33.62,7.49 33.31,7.18 R31.2 R34.1
N$33  (via drill 0.35)
  Top 0.305: X3.GND3 X3.GND1 X3.GND2 X3.GND4 84.3,50.8 81.63,53.47 71.47,53.47 69.82,51.82 69.82,49.78 69.06,49.02 62.58,49.02 v61.95,48.39 | v61.95,40.39 61.95,40.01 60.93,38.99 59.53,38.99 58.9,39.62 45.31,39.62 44.99,39.3 R66.1
  Bottom 0.305: v61.95,48.39 v61.95,40.39
N$34  (via drill 0.35)
  Top 0.305: v60.17,48.39 60.17,49.02 61.31,50.16 68.42,50.16 68.68,50.42 68.68,52.32 70.96,54.61 82.14,54.61 83.41,53.34 X3.ANTENNA | v60.17,40.39 60.17,40.51 59.91,40.77 41.37,40.77 40.48,39.88 R64.1
  Bottom 0.305: v60.17,48.39 v60.17,40.39
N$35
  Top 0.305: C17.1 87.6,15.24 | IC3.3 76.55,40.39 76.8,40.13 76.8,34.29 | 72.99,36.9 R15.2 72.8,34.86 73.38,34.29 76.8,34.29 | R16.1 82.39,31.88 | 82.39,31.88 82.39,14.48 82.9,13.97 | 82.39,31.88 81.12,31.88 80.61,32.38 80.61,33.91 80.23,34.29 76.8,34.29
  pour Top (no thermals): 91.54,15.37 81.12,15.37 81.12,7.75 84.17,7.75 84.17,12.45 86.71,12.45 87.34,13.08 91.54,13.08
N$36
  Top 0.305: R45.1 R42.2 12.8,12.83 13.94,11.68 JP7.2
N$37
  Top 0.305: R7.1 43.34,85.28 JP5.1
N$38
  Top 0.305: IC8.3 38.38,32.26 R65.1 37.69,32.7 37.69,35.18 38.7,36.2 40.35,36.2 40.48,36.32 R64.2
N$39
  Top 0.305: R33.1 R32.2 42.07,6.92 41.5,7.49 41.5,9.02 41.24,9.27 U4.9
N$40
  Top 0.305: R44.1 R43.2 17.62,12.95 19.02,11.56 JP7.4
N$41
  Top 0.305: R40.2 R37.1 30.89,7.43 31.46,8 32.1,8 32.48,8.38 32.48,9.91 33.12,10.54 U4.5
N$42
  Top 0.305: R41.2 R38.1 44.23,16.2 43.66,15.62 43.02,15.62 42.64,15.24 42.64,13.72 42.01,13.08 U4.12
N$43
  Top 0.305: JP7.5 21.56,12.19 22.45,13.08 R47.2 R46.2
N$44
  Top 0.203: U1.1 9.92,36.28 9.39,36.8 7.77,36.8 Y1.P$2 7.74,39.54 C55.2
N$45
  Top 0.203: 4.54,36.93 Y1.P$1 | Y1.P$1 4.64,39.46 C56.2 | U1.2 9.71,35.78 9.24,35.31 5.05,35.31 4.64,35.71 Y1.P$1
N$46
  Top 0.203: TR1.3 15.23,65.25 14.74,65.75 IC10.4
  Top 0.254: IC10.4 13.45,67.74 R60.1 R61.2
N$47  (via drill 0.35)
  Top 0.305: R67.1 50.07,29.4 48.1,27.43 v47.09,27.43 | IC8.2 41.62,33.53 41.88,33.27 v41.88,32.89 41.88,33.66 42.13,33.91 42.13,35.94 43.09,36.9 R66.2
  Bottom 0.305: v47.09,27.43 46.7,27.43 45.56,28.57 45.56,32.51 45.18,32.89 v41.88,32.89
N$48
  Top 0.203: U1.30 26.17,33.28 27.15,34.26 JP10.3
N$49
  Top 0.203: U1.29 28.14,32.78 29.69,34.32 JP10.2
N$50
  Top 0.305: IC9.2 IC9.1 55.09,5.97 54.96,5.84 R49.2
N$51
  Top 0.305: R51.2 R48.1 58.9,15.3 IC9.5
N$52
  Top 0.305: R50.2 52.99,9.08 53.44,9.53 55.85,9.53 57.63,11.3 IC9.6 | 52.99,7.74 R50.2 | R50.2 52.99,8.19 52.29,7.49 52.29,7.37 51.66,6.73 51.66,6.6 51.09,6.04 R49.1
N$53
  Top 0.203: U1.28 29.86,32.28 32.23,34.64 JP10.1
N$54
  Top 0.305: IC9.7 56.36,11.68 55.34,10.67 51.53,10.67 51.09,10.23 R50.1 49.63,8.26 49.37,8 49.37,3.68 49.63,3.43 RMON.2
N$55
  Top 0.305: R55.2 R54.1 44.48,7.05 43.53,8 42.9,8 42.64,8.26 42.64,9.91 42.01,10.54 U4.10
N$56
  Top 0.305: U4.13 41.24,14.35 41.5,14.61 41.5,16.13 41.81,16.44 R52.2 R53.1
PA04_AIN4
  Top 0.254: U1.9 9.26,32.28 8.86,31.88 8.86,29.59 7.97,28.7 6.7,28.7 6.32,28.32 JP8.2
PA05_AIN5
  Top 0.254: U1.10 10.03,31.78 9.88,31.62 9.88,29.21 8.86,28.19 JP8.1
PA28_USB_HOST_EN  (via drill 0.35)
  Top 0.203: R63.1 3.65,48.64 4.29,48.01 v7.21,48.01 | U1.41 16.09,39.2 17.14,40.26 18.29,40.26 18.54,40.51 18.54,44.83 18.03,45.34 16.76,45.34 15.88,46.23 14.1,46.23 13.84,46.48 13.84,47.98 v13.56,48.39
  Bottom 0.203: v7.21,48.01 9.65,48.01 10.03,48.39 v13.56,48.39
RESET  (via drill 0.33)
  Top 0.203: v15.11,47.5 15.11,47.24 15.24,47.12 16.26,47.12 17.14,46.23 18.41,46.23 20.16,44.48 20.16,44.07
  Top 0.254: R56.1 20.16,44.07 20.16,44.67 20.45,44.96 21.34,44.96 | 21.34,44.96 S1.3 | R30.1 21.66,50.99 21.34,50.67 21.34,44.96
  Bottom 0.203: J1.10 10.29,47.12 10.54,47.37 12.83,47.37 13.08,47.12 14.73,47.12 v15.11,47.5
SCK_DAC
  Top 0.254: R39.1 28.54,20.77 28.54,25.15 27.27,26.42 26.51,26.42 25.5,27.43 18,27.43 17.59,27.85 U1.23
SCL
  Top 0.203: R58.1 32.73,43.56 JP3.7 JP3.8 35.15,44.58 35.4,44.32 35.4,38.48 35.01,38.09 35,38.1 26.16,38.1 25.02,36.96 25.02,34.8 24.5,34.28 U1.32
SDA
  Top 0.203: R57.1 30.2,46.74 30.58,47.12 JP3.5 JP3.6 35.53,47.12 35.91,46.74 35.91,38.23 35.27,37.59 26.41,37.59 25.53,36.7 25.53,34.67 24.63,33.78 U1.31
SWDCLK
  Top 0.203: U1.45 14.09,38.87 13.46,39.5 9.14,39.5 8.89,39.75 8.89,41.78 9.27,42.16 J1.4
SWDIO  (via drill 0.33)
  Top 0.203: U1.46 13.59,38.74 13.34,38.99 10.54,38.99 10.29,38.73 v10.29,38.64
  Bottom 0.203: v10.29,38.64 J1.2
TARGET_RESET
  Top 0.203: U1.40 16.59,38.97 16.99,39.37 19.81,39.37 20.16,39.72 R56.2 C23.1
TARGET_USB_N
  Top 0.152: 26,50.69 25.98,50.93
  Top 0.203: USB.D- 81.92,84.29 76.04,90.17 20.8,90.17 20.39,89.76 20.39,63.34 25.98,57.75 25.98,50.93 25.98,38.68 24.51,37.21 24.51,35.18 24.11,34.78 U1.33
TARGET_USB_P
  Top 0.203: USB.D+ 81.76,85.09 76.17,90.68 20.73,90.68 19.93,89.88 19.93,63.15 25.52,57.56 25.52,38.8 24.11,37.38 24.11,35.43 23.95,35.28 U1.34
USB_ID  (via drill 0.35)
  Top 0.203: USB.ID 81.59,85.89 76.3,91.19 18.38,91.19 17.24,90.04 17.24,80.14 16.86,79.76 10.76,79.76 8.61,77.6 v8.61,69.98 | v8.48,67.44 8.1,67.06 8.1,63.5 8.29,63.31 R62.1 10.99,63.31 11.14,63.47 v11.14,63.95 11.24,64.05 IC10.1 | R63.2 3.65,55.88 2,57.53 2,61.59 2.51,62.1 4.03,62.1 v5.68,63.75
  Top 0.254: IC10.1 IC10.2
  Bottom 0.203: v11.14,63.95 5.88,63.95 v5.68,63.75 | v8.61,69.98 8.61,67.56 v8.48,67.44
USBVCC
  Top 0.305: F1.2 15.46,74.3 15.15,73.98 15.15,71.12 C36.2
  Top 0.406: 15.21,71.06 C36.2 R59.2 15.28,66.87 15.72,66.42 TR1.1
V+
  Top 0.203: TP1.P$1 67.66,83.82 | R22.2 62.9,83.75 62.96,83.69
  pour Top (no thermals): 73.88,70.74 70.07,70.74 70.07,82.42 56.87,82.42 56.87,77.6 54.2,77.6 54.2,82.01 54.99,82.8 54.99,87.88 56.77,87.88 56.77,83.82 73.88,83.82
V-
  Top 0.203: R21.2 62.9,56.83 62.58,57.15 | TP2.P$1 67.66,57.4
  pour Top (no thermals): 73.88,68.96 58.64,68.96 58.64,56.77 73.88,56.77
VCCINT  (via drill 0.35)
  Top 0.305: C9.+ C10.+ 63.6,36.7 | 72.61,18.09 C11.1 70.64,18.22 70.58,18.16 | R27.1 65.37,22.61 | 65.25,27.3 65.37,27.18 | C30.1 C31.1 C32.1 | v54.96,24.89 55.09,24.77 U3.8 58.24,25.57 59.2,25.57 60.29,26.67 C32.1 | v54.33,22.1 54.2,22.23 U3.3 | R48.2 62.83,15.37 62.96,15.49 | C32.1 61.25,28.13 61.56,28.45 65.37,28.45
  Top 0.61: IC2.1 43.28,48.91 43.28,45.72 | 65.37,18.29 65.37,22.61 65.37,27.18 65.37,28.45 65.37,30.1 63.6,31.88 63.6,36.7 63.6,41.91 63.47,42.04 42.9,42.04
  Bottom 0.305: v54.33,22.1 54.71,22.48 54.71,24.64 v54.96,24.89
  pour Top (no thermals): 36.29,60.45 36.29,56.52 39.09,56.52 41.37,54.23 41.37,41.91 43.78,41.91 43.78,44.45 45.05,45.72 43.91,46.86 43.91,60.45
  pour Top (no thermals): 62.45,15.37 70.96,15.37 70.96,18.41 62.45,18.41
VDDCORE
  Top 0.254: U1.43 15.09,39.6 16.86,41.37 C53.1
VIN  (via drill 0.35)
  Top 0.203: R67.2 48.17,29.4 47.59,28.83 46.32,28.83 44.67,27.18 36.93,27.18 34.13,24.38 32.23,24.38 31.97,24.64 31.97,26.67 28.8,29.84 19.02,29.84 18,30.86 16.35,30.86 15.84,31.37 v15.84,33.66 | U1.47 13.09,33.87 v13.3,33.66
  Top 0.254: R67.2 47.21,30.61 46.96,30.86 46.96,32.13 46.83,32.26 IC8.6
  Bottom 0.203: v13.3,33.66 v15.84,33.66
VMON  (via drill 0.35)
  Top 0.305: R55.1 v47.98,3.56 | 53.12,3.3 RMON.1 53.12,3.56 v54.45,3.56
  Bottom 0.305: v47.98,3.56 v54.45,3.56
XUSB  (via drill 0.35)
  Top 0.305: USB.VBUS 81.96,83.49 75.79,89.66 22.07,89.66 v21.69,89.28 | v18.64,89.28 18.64,78.99 18.26,78.61 13.69,78.61 13.13,78.06 F1.1 13.13,73.49 12.99,73.34 C35.1
  Bottom 0.305: v21.69,89.28 v18.64,89.28

## Text on the board
tNames: ENBL LED | V+ | V+ | GND | V- | ENBL SW | ANA IN | V- | MOD IN | RF IN | + | - | LD OUT | Ultra Low-Noise / Laser Diode Driver | A. Impertro, Rev 1.1, 2018
Document: HI CUR REG | +12V | PWR IN | I2C | 3V3 | -12V | GND | +5V | GND | SWD | +3V3 | GND | SDA | SCL | D0 | D1 | D2 | A0 | A0 | DIG I/O | ANA I/O | 5V | B | GND | A | BTN | ENCODER